# EAGLE design Transceiver schematic (EAGLE 9.5.0)
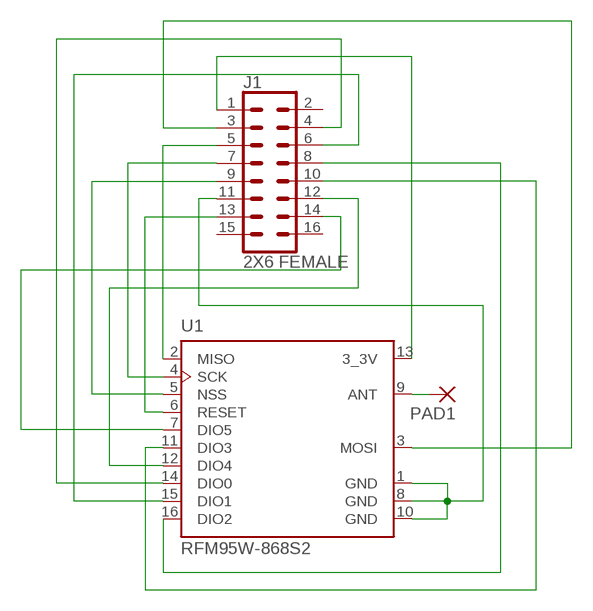
[diagram p0: schematic, sheet 1]

## Parts
J1  2X6 FEMALE  SENSOR_BREAKOUTPTH_FEMALE  [2X7]
PAD1  2,54/1,0  [2,54/1,0]
U1  RFM95W-868S2  [XCVR_RFM95W-868S2]

## Nets
N$1: J1.11 U1.1(GND) U1.8(GND) U1.10(GND)
N$2: J1.3 U1.3(MOSI)
N$3: J1.5 U1.2(MISO)
N$4: J1.7 U1.4(SCK)
N$5: J1.1 U1.13(3_3V)
N$6: J1.4 U1.14(DIO0)
N$7: J1.9 U1.5(NSS)
N$8: J1.6 U1.15(DIO1)
N$9: J1.8 U1.16(DIO2)
N$10: J1.10 U1.11(DIO3)
N$11: J1.12 U1.12(DIO4)
N$12: PAD1.1(P) U1.9(ANT)
N$13: J1.13 U1.6(RESET)
N$14: J1.14 U1.7(DIO5)
Unconnected: J1.2 J1.15 J1.16

## Library data of the parts
J1 = RTR:SENSOR_BREAKOUT: .1 inch-spaced 12P sensor breakout Used as a generalized connector for attaching new sensors; PROD_ID: CONN-12423
PAD1 = wirepad:2,54/1,0: THROUGH-HOLE PAD
U1 = RFM95W-868S2:RFM95W-868S2: Mod Txrx Lora +20dbm 868mhz Smd; AVAILABILITY: Unavailable; MF: RF; MP: RFM95W-868S2; PACKAGE: SMD-16 Hope Microelectronics; PRICE: None

## Board
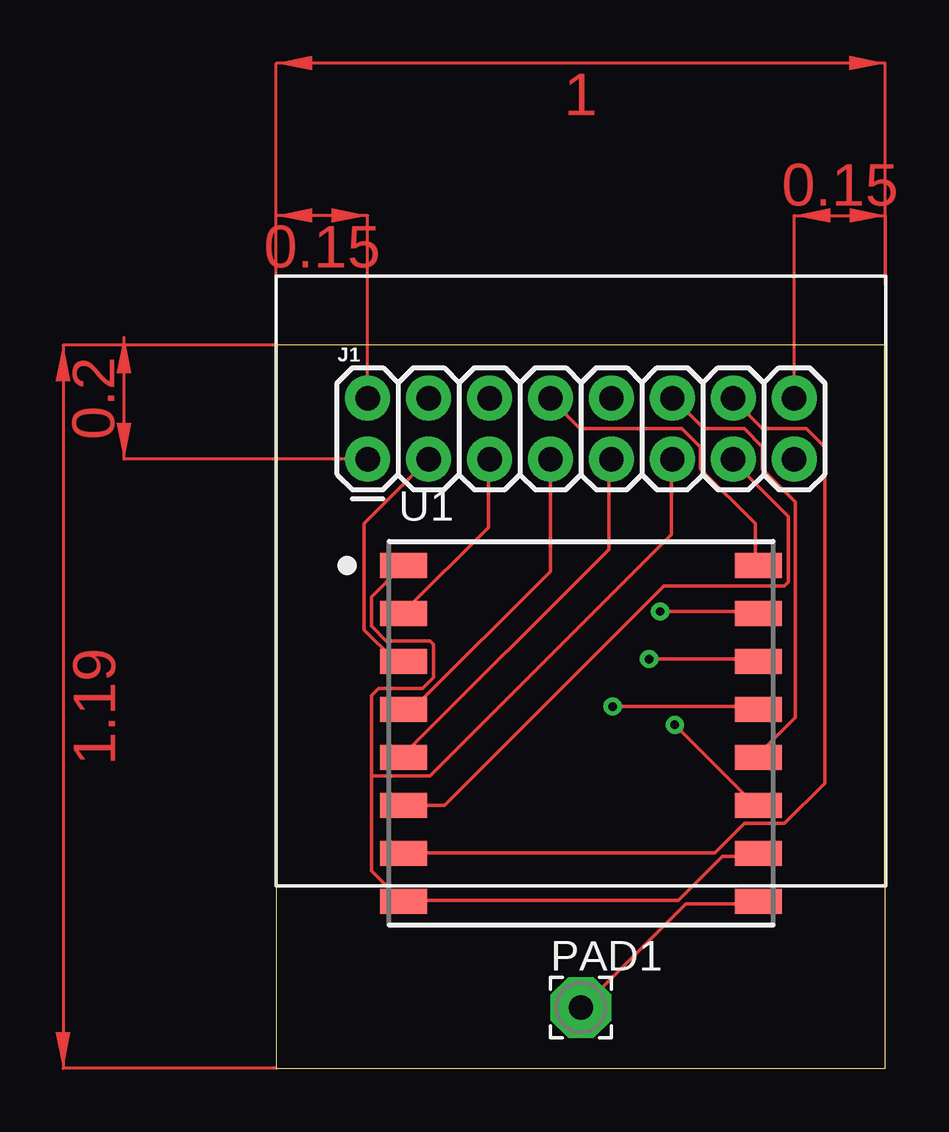
[diagram p1: board, top side]
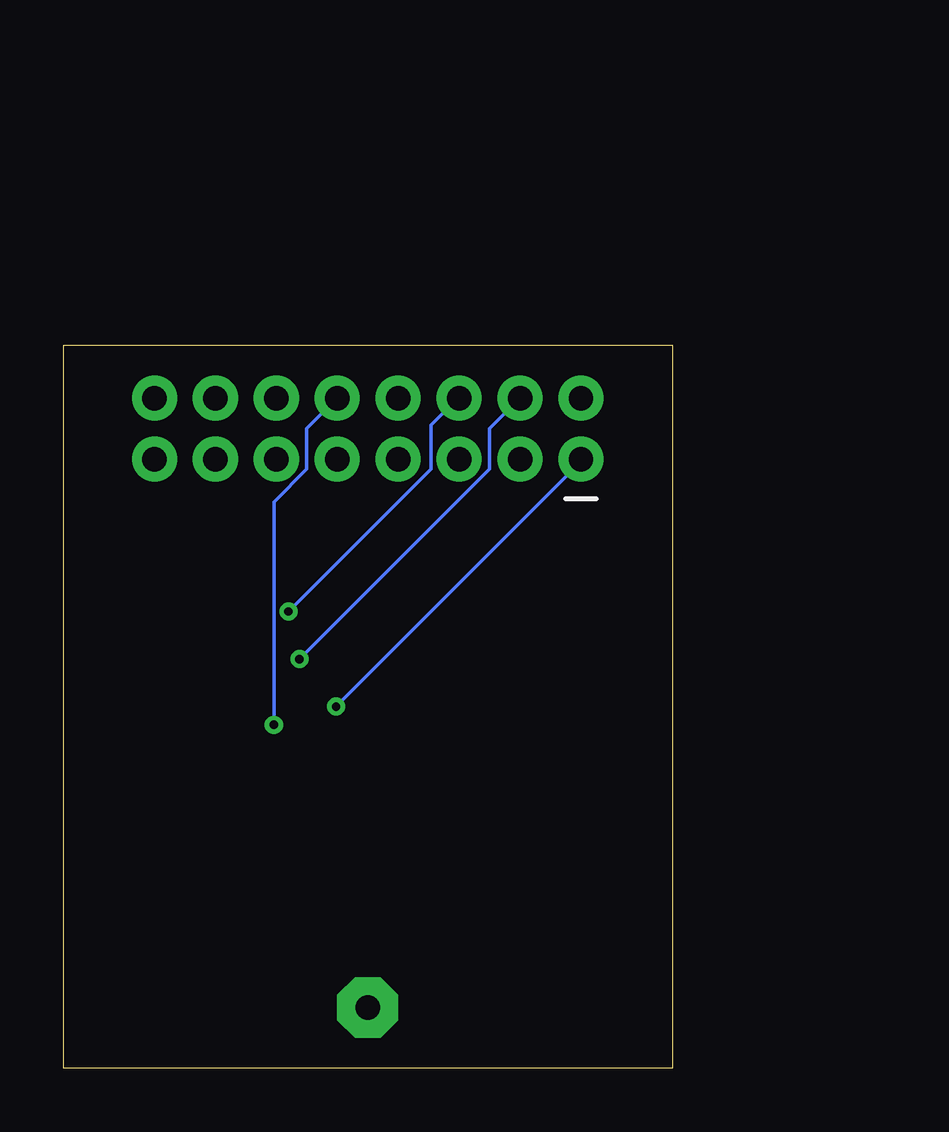
[diagram p2: board, bottom side, seen from below]

Size 25.38 x 30.15 mm. Coordinates in mm from the lower left corner, seen from the top.
Outline: 0,0 25.38,0 25.38,30.15 0,30.15 0,0
Copper layers (1*16): Top 0.035mm / dielectric 1.5mm / Bottom 0.035mm
Design rules "default": minimum track width 6mil, minimum drill 0.35mm, track to track 6mil, track to pad 6mil, pad to pad 6mil, via to via 6mil, smd to smd 6mil, copper to edge 40mil, drill to drill 6mil, minimum pad ring 10mil, minimum via ring 8mil, stop-mask expansion 4mil, vias tented up to drill 0mil, thermal gap 10mil

### Footprints (pad centres in the part's own frame; a part is rotated, then mirrored left to right if it is on the bottom)
2X7 = drill 1.016 pad 1.88: 1 -8.89,5.08; 2 -8.89,7.62; 3 -6.35,5.08; 4 -6.35,7.62; 5 -3.81,5.08; 6 -3.81,7.62; 7 -1.27,5.08; 8 -1.27,7.62; 9 1.27,5.08; 10 1.27,7.62; 11 3.81,5.08; 12 3.81,7.62; 13 6.35,5.08; 14 6.35,7.62; 15 8.89,5.08; 16 8.89,7.62
2,54/1,0 = drill 1.016 pad 2.54 octagon: 1 0,0
XCVR_RFM95W-868S2 = smd 1.95 x 1.05: 1 -7.4,7; 2 -7.4,5; 3 -7.4,3; 4 -7.4,1; 5 -7.4,-1; 6 -7.4,-3; 7 -7.4,-5; 8 -7.4,-7; 9 7.4,-7; 10 7.4,-5; 11 7.4,-3; 12 7.4,-1; 13 7.4,1; 14 7.4,3; 15 7.4,5; 16 7.4,7

### Placement (x,y rotation side)
J1  12.7,20.32 0 top
PAD1  12.7,2.54 0 top
U1  12.7,13.97 0 top

### Tracks (layer width: path | path; a pad name or v marks a point on that pad's centre or on a via)
N$1
  Top 0.152: U1.10 19.96,8.84 18.59,8.84 16.76,7.01 5.33,7.01 U1.8 5.18,7.01 3.96,8.23 3.96,12.19 | 3.96,12.19 3.96,15.54 4.27,15.85 6.1,15.85 6.55,16.31 6.55,17.68 6.4,17.83 4.57,17.83 3.96,18.44 3.96,19.66 5.18,20.88 U1.1 | 3.96,12.19 6.4,12.19 16.46,22.25 16.46,25.3 J1.11
N$2
  Top 0.152: J1.3 3.66,22.71 3.66,18.29 4.88,17.07 5.18,17.07 U1.3
N$3
  Top 0.152: U1.2 5.33,19.05 8.84,22.55 8.84,25.3 J1.5
N$4
  Top 0.152: J1.7 11.43,20.73 5.79,15.09 5.33,15.09 U1.4
N$5  (via drill 0.35)
  Top 0.152: v14.02,15.09 19.96,15.09 U1.13
  Bottom 0.152: v14.02,15.09 3.81,25.3 J1.1
N$6  (via drill 0.35)
  Top 0.152: v15.54,17.07 19.96,17.07 U1.14
  Bottom 0.152: v15.54,17.07 7.62,24.99 7.62,26.67 J1.4
N$7
  Top 0.152: U1.5 5.33,13.11 13.87,21.64 13.87,25.3 J1.9
N$8  (via drill 0.35)
  Top 0.152: v16,19.05 19.96,19.05 U1.15
  Bottom 0.152: v16,19.05 10.06,24.99 10.06,26.82 8.99,27.89 J1.6
N$9
  Top 0.152: U1.16 19.96,21.03 19.96,22.71 17.68,24.99 17.68,25.91 16.92,26.67 12.65,26.67 11.43,27.89 J1.8
N$10  (via drill 0.35)
  Top 0.152: v16.61,14.33 19.96,10.97 U1.11
  Bottom 0.152: v16.61,14.33 16.61,23.62 15.24,24.99 15.24,26.67 J1.10
N$11
  Top 0.152: U1.12 20.12,13.11 21.64,14.63 21.64,23.62 20.27,24.99 20.27,25.91 19.51,26.67 17.83,26.67 16.61,27.89 J1.12
N$12
  Top 0.152: U1.9 19.96,6.86 17.07,6.86 12.8,2.59 PAD1.1
N$13
  Top 0.152: U1.6 5.33,10.97 7.01,10.97 16.15,20.12 21.18,20.12 21.34,20.27 21.34,23.01 19.05,25.3 J1.13
N$14
  Top 0.152: U1.7 5.33,8.99 18.29,8.99 19.51,10.21 21.18,10.21 22.86,11.89 22.86,25.91 22.1,26.67 20.27,26.67 19.05,27.89 J1.14
(copper drawn outside any net)
  shapes: Top area x5